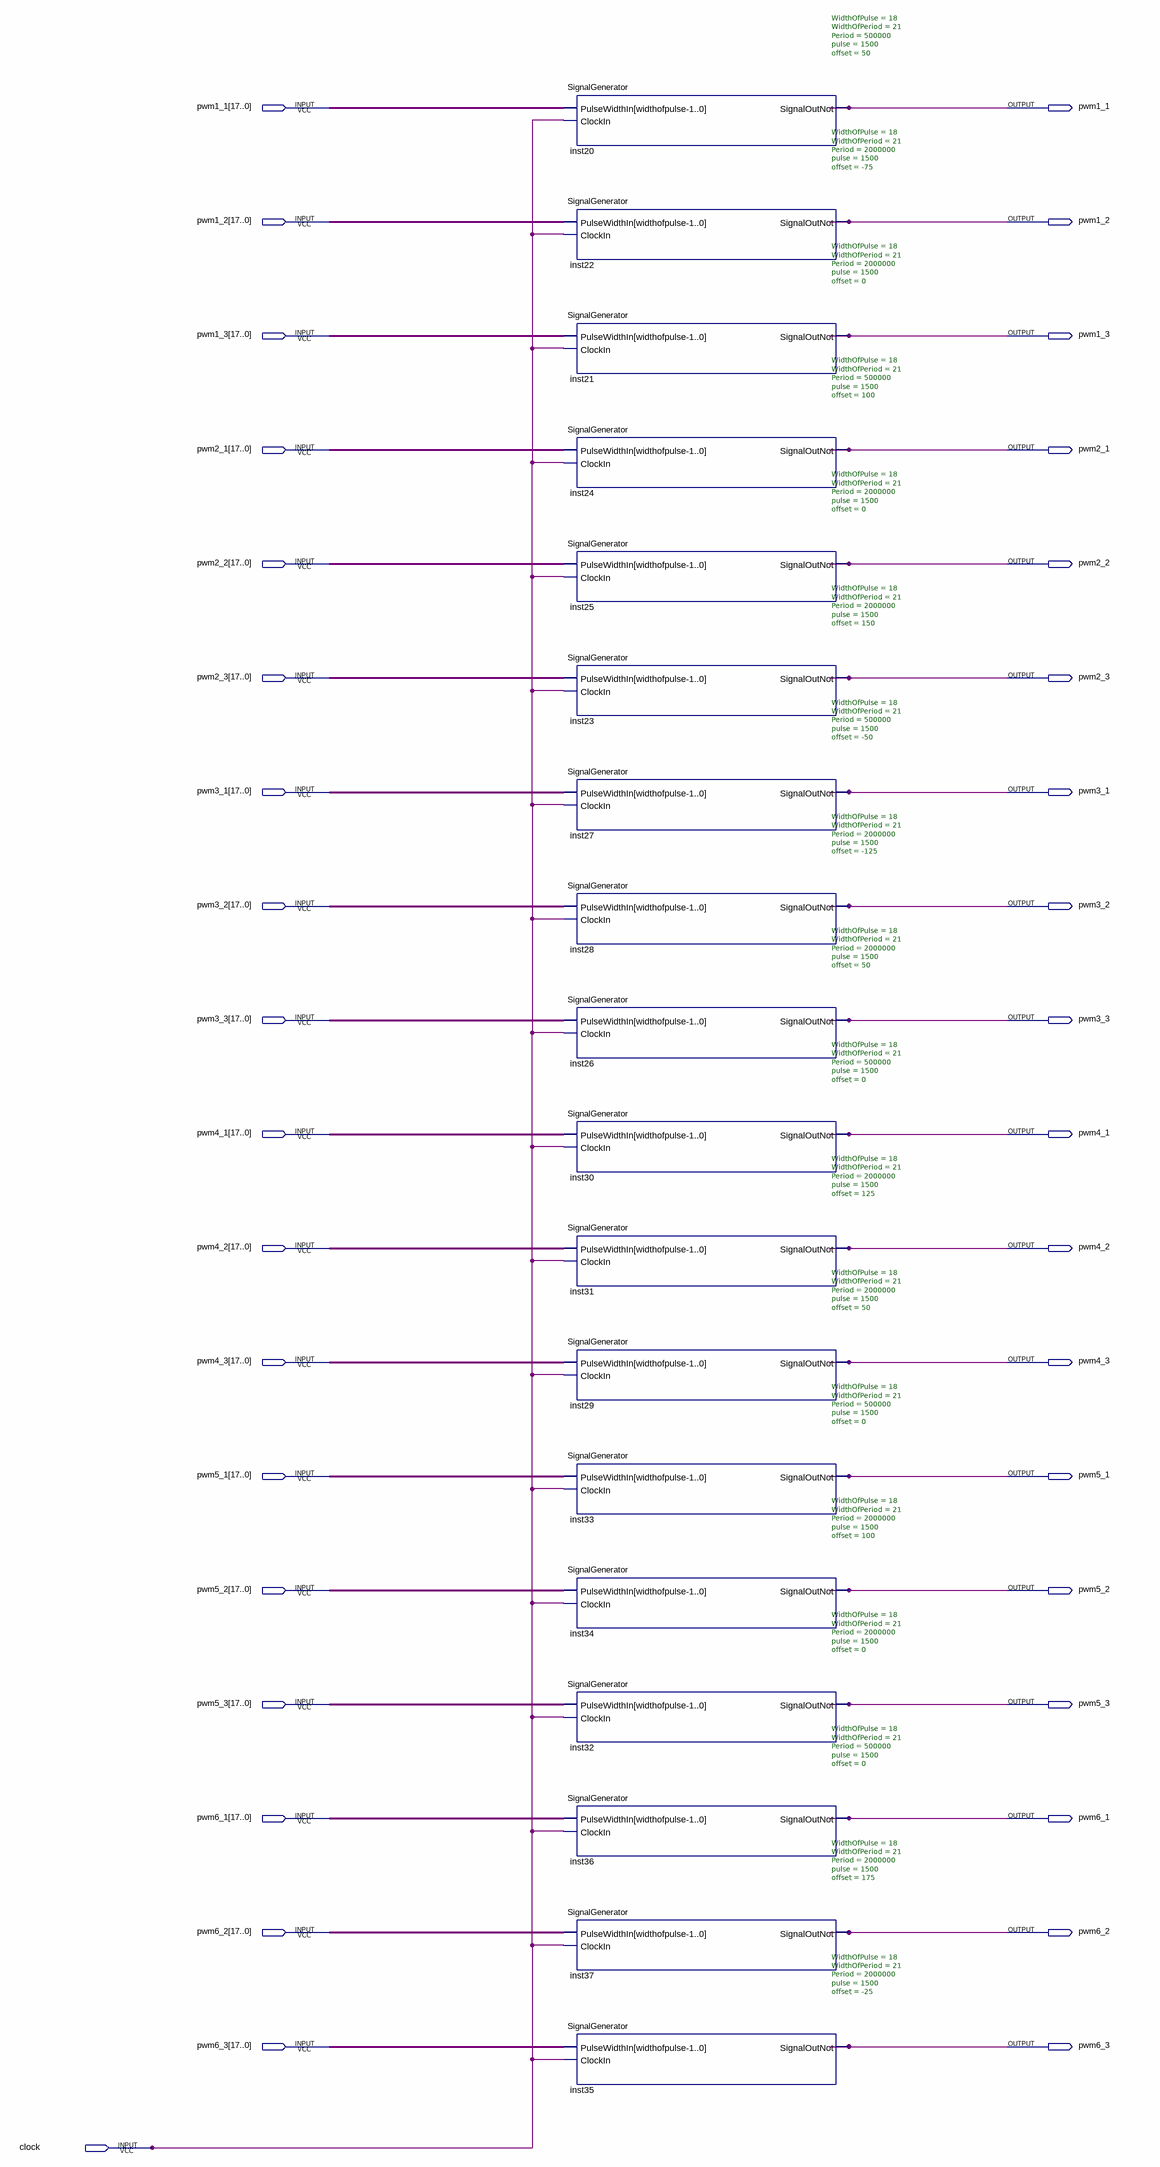
[diagram p0: schematic sheet]
// Quartus schematic bot_pulse.bdf as structural Verilog: 18 symbols, 37 pins
module bot_pulse (
  input  [17:0] pwm1_1,
  input  [17:0] pwm1_2,
  input  [17:0] pwm1_3,
  input  [17:0] pwm2_1,
  input  [17:0] pwm2_2,
  input  [17:0] pwm2_3,
  input  [17:0] pwm3_1,
  input  [17:0] pwm3_2,
  input  [17:0] pwm3_3,
  input  [17:0] pwm4_1,
  input  [17:0] pwm4_2,
  input  [17:0] pwm4_3,
  input  [17:0] pwm5_1,
  input  [17:0] pwm5_2,
  input  [17:0] pwm5_3,
  input  [17:0] pwm6_1,
  input  [17:0] pwm6_2,
  input  [17:0] pwm6_3,
  input  clock,
  output pwm1_1_1bit,
  output pwm1_2_1bit,
  output pwm1_3_1bit,
  output pwm2_1_1bit,
  output pwm2_2_1bit,
  output pwm2_3_1bit,
  output pwm3_1_1bit,
  output pwm3_2_1bit,
  output pwm3_3_1bit,
  output pwm4_1_1bit,
  output pwm4_2_1bit,
  output pwm4_3_1bit,
  output pwm5_1_1bit,
  output pwm5_2_1bit,
  output pwm5_3_1bit,
  output pwm6_1_1bit,
  output pwm6_2_1bit,
  output pwm6_3_1bit
);

  SignalGenerator #(.WidthOfPulse(18), .WidthOfPeriod(21), .Period(500000), .pulse(1500), .offset(50)) inst20 (
    .PulseWidthIn(pwm1_1), .ClockIn(clock), .SignalOutNot(pwm1_1_1bit));
  SignalGenerator #(.WidthOfPulse(18), .WidthOfPeriod(21), .Period(2000000), .pulse(1500), .offset(-75)) inst22 (
    .PulseWidthIn(pwm1_2), .ClockIn(clock), .SignalOutNot(pwm1_2_1bit));
  SignalGenerator #(.WidthOfPulse(18), .WidthOfPeriod(21), .Period(2000000), .pulse(1500), .offset(0)) inst21 (
    .PulseWidthIn(pwm1_3), .ClockIn(clock), .SignalOutNot(pwm1_3_1bit));
  SignalGenerator #(.WidthOfPulse(18), .WidthOfPeriod(21), .Period(500000), .pulse(1500), .offset(100)) inst24 (
    .PulseWidthIn(pwm2_1), .ClockIn(clock), .SignalOutNot(pwm2_1_1bit));
  SignalGenerator #(.WidthOfPulse(18), .WidthOfPeriod(21), .Period(2000000), .pulse(1500), .offset(0)) inst25 (
    .PulseWidthIn(pwm2_2), .ClockIn(clock), .SignalOutNot(pwm2_2_1bit));
  SignalGenerator #(.WidthOfPulse(18), .WidthOfPeriod(21), .Period(2000000), .pulse(1500), .offset(150)) inst23 (
    .PulseWidthIn(pwm2_3), .ClockIn(clock), .SignalOutNot(pwm2_3_1bit));
  SignalGenerator #(.WidthOfPulse(18), .WidthOfPeriod(21), .Period(500000), .pulse(1500), .offset(-50)) inst27 (
    .PulseWidthIn(pwm3_1), .ClockIn(clock), .SignalOutNot(pwm3_1_1bit));
  SignalGenerator #(.WidthOfPulse(18), .WidthOfPeriod(21), .Period(2000000), .pulse(1500), .offset(-125)) inst28 (
    .PulseWidthIn(pwm3_2), .ClockIn(clock), .SignalOutNot(pwm3_2_1bit));
  SignalGenerator #(.WidthOfPulse(18), .WidthOfPeriod(21), .Period(2000000), .pulse(1500), .offset(50)) inst26 (
    .PulseWidthIn(pwm3_3), .ClockIn(clock), .SignalOutNot(pwm3_3_1bit));
  SignalGenerator #(.WidthOfPulse(18), .WidthOfPeriod(21), .Period(500000), .pulse(1500), .offset(0)) inst30 (
    .PulseWidthIn(pwm4_1), .ClockIn(clock), .SignalOutNot(pwm4_1_1bit));
  SignalGenerator #(.WidthOfPulse(18), .WidthOfPeriod(21), .Period(2000000), .pulse(1500), .offset(125)) inst31 (
    .PulseWidthIn(pwm4_2), .ClockIn(clock), .SignalOutNot(pwm4_2_1bit));
  SignalGenerator #(.WidthOfPulse(18), .WidthOfPeriod(21), .Period(2000000), .pulse(1500), .offset(50)) inst29 (
    .PulseWidthIn(pwm4_3), .ClockIn(clock), .SignalOutNot(pwm4_3_1bit));
  SignalGenerator #(.WidthOfPulse(18), .WidthOfPeriod(21), .Period(500000), .pulse(1500), .offset(0)) inst33 (
    .PulseWidthIn(pwm5_1), .ClockIn(clock), .SignalOutNot(pwm5_1_1bit));
  SignalGenerator #(.WidthOfPulse(18), .WidthOfPeriod(21), .Period(2000000), .pulse(1500), .offset(100)) inst34 (
    .PulseWidthIn(pwm5_2), .ClockIn(clock), .SignalOutNot(pwm5_2_1bit));
  SignalGenerator #(.WidthOfPulse(18), .WidthOfPeriod(21), .Period(2000000), .pulse(1500), .offset(0)) inst32 (
    .PulseWidthIn(pwm5_3), .ClockIn(clock), .SignalOutNot(pwm5_3_1bit));
  SignalGenerator #(.WidthOfPulse(18), .WidthOfPeriod(21), .Period(500000), .pulse(1500), .offset(0)) inst36 (
    .PulseWidthIn(pwm6_1), .ClockIn(clock), .SignalOutNot(pwm6_1_1bit));
  SignalGenerator #(.WidthOfPulse(18), .WidthOfPeriod(21), .Period(2000000), .pulse(1500), .offset(175)) inst37 (
    .PulseWidthIn(pwm6_2), .ClockIn(clock), .SignalOutNot(pwm6_2_1bit));
  SignalGenerator #(.WidthOfPulse(18), .WidthOfPeriod(21), .Period(2000000), .pulse(1500), .offset(-25)) inst35 (
    .PulseWidthIn(pwm6_3), .ClockIn(clock), .SignalOutNot(pwm6_3_1bit));
endmodule
